# Altium schematic sheet Eth_Switch.SchDoc
size A3
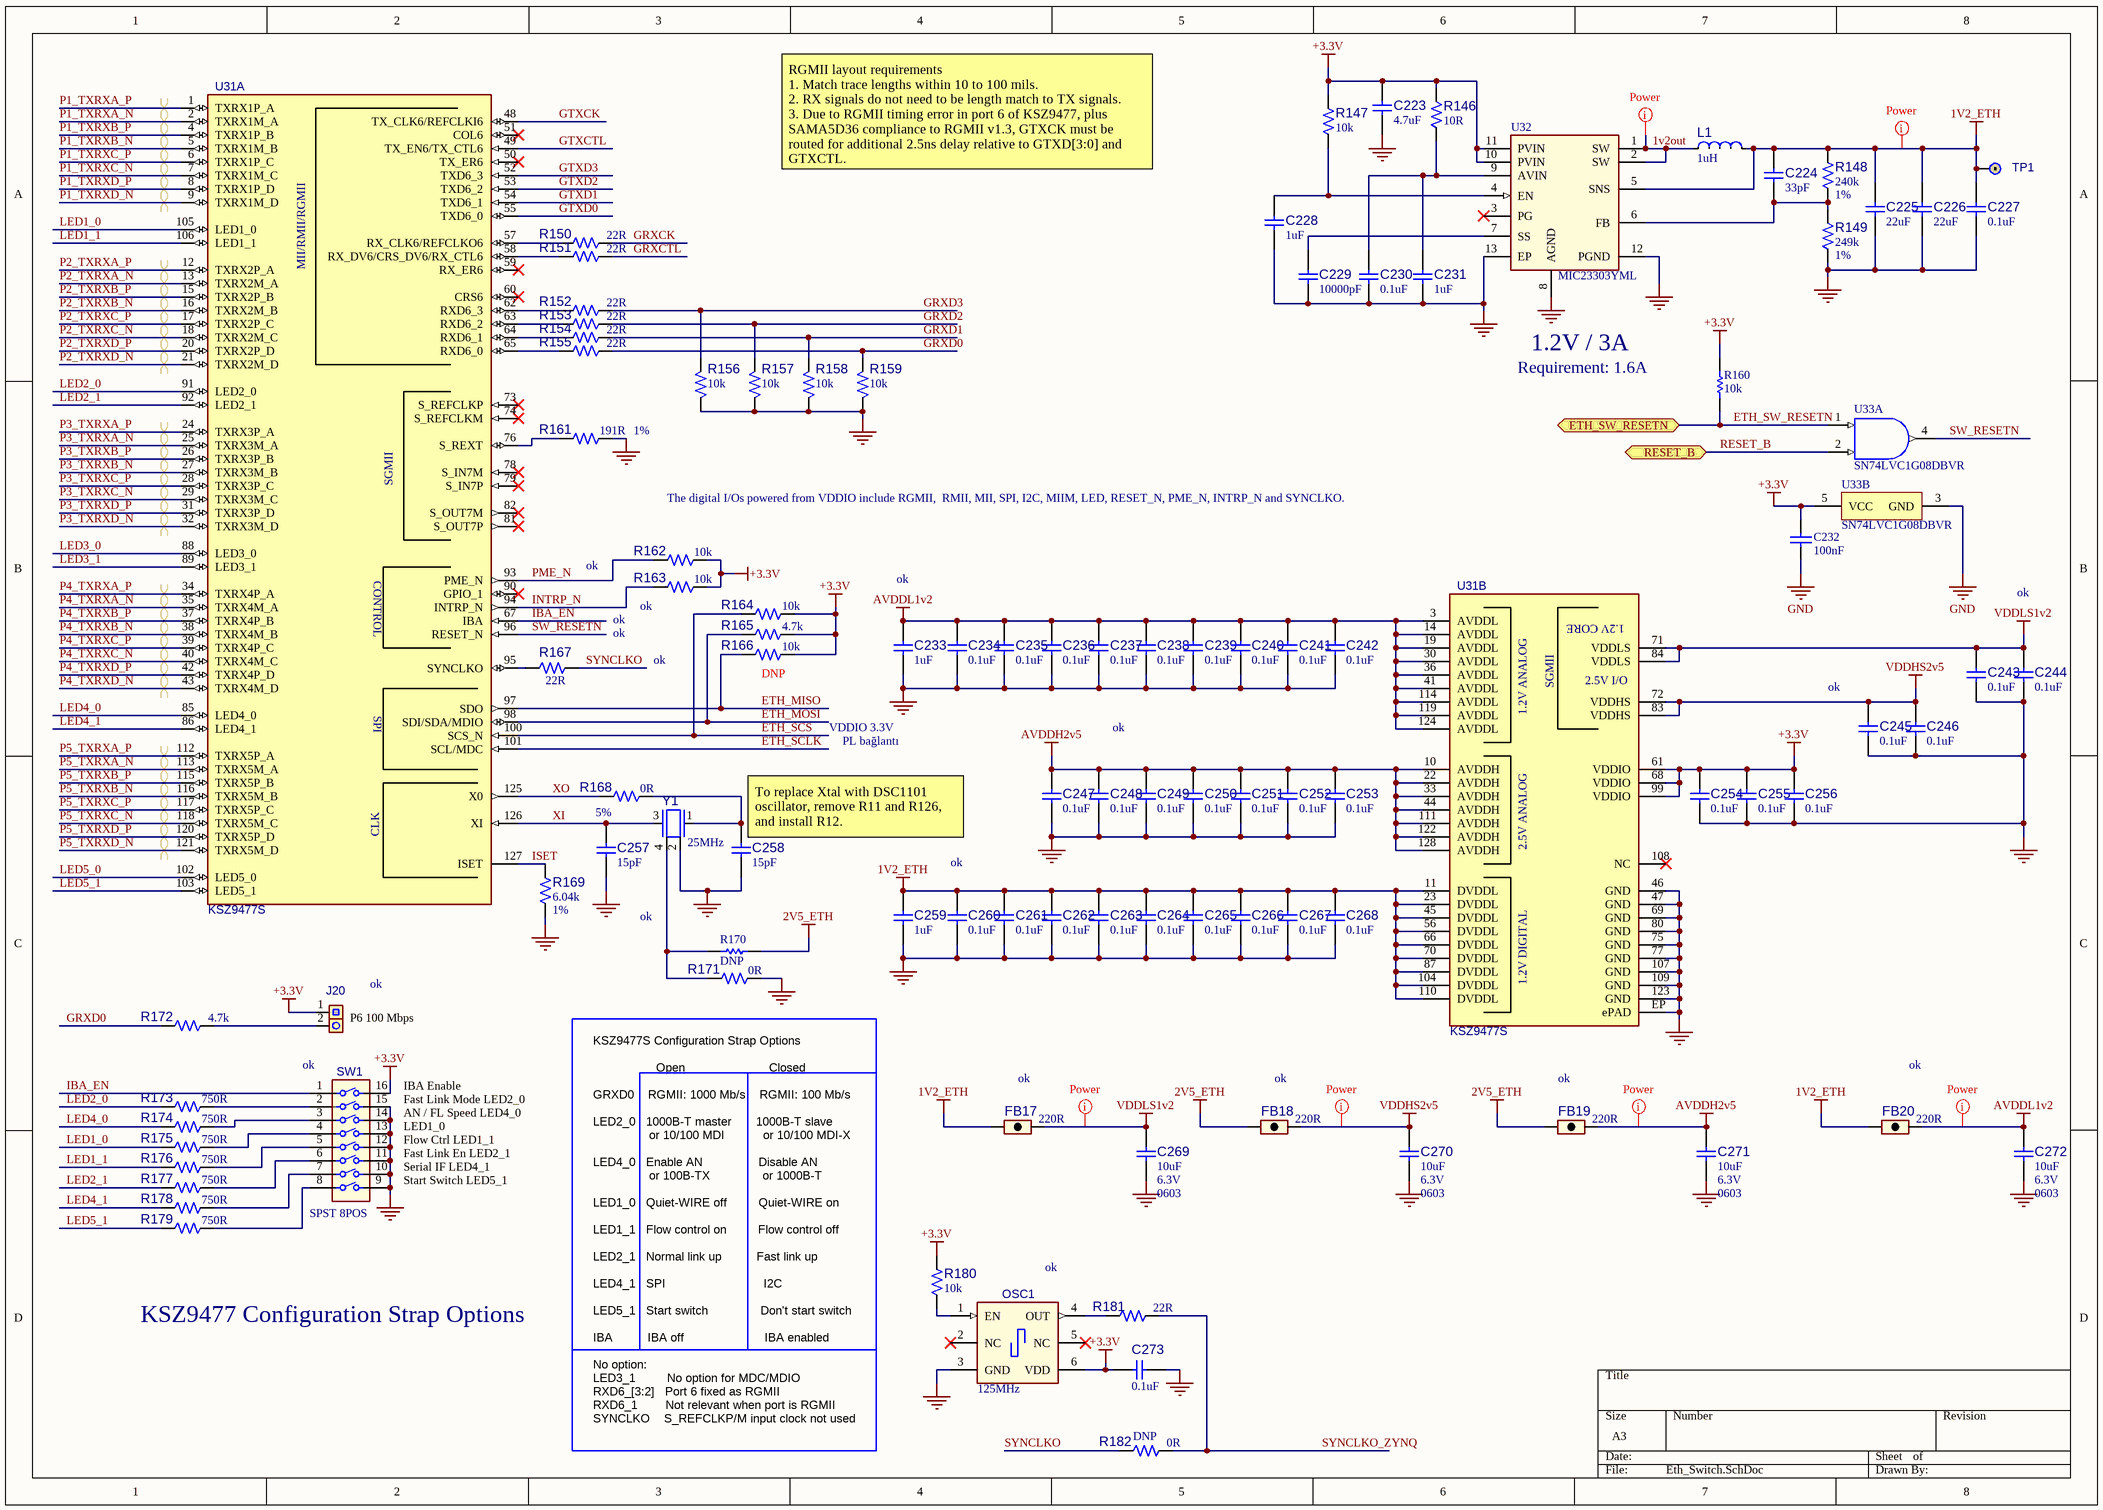
[diagram p0: Eth_Switch.SchDoc]

## Parts
C223  value 4.7uF  [CAP_C_0603]  (hidden comment: Capacitor NP)
C224  value 33pF  [CAP_C_0603]  (hidden comment: Capacitor NP)
C225  value 22uF  [CAP_C_0805]  (hidden comment: Capacitor NP)
C226  value 22uF  [CAP_C_0805]  (hidden comment: Capacitor NP)
C227  value 0.1uF  [CAP_C_0402]  (hidden comment: Capacitor NP)
C228  value 1uF  [CAP_C_0402]  (hidden comment: Capacitor NP)
C229  value 10000pF  [CAP_C_0402]  (hidden comment: Capacitor NP)
C230  value 0.1uF  [CAP_C_0402]  (hidden comment: Capacitor NP)
C231  value 1uF  [CAP_C_0402]  (hidden comment: Capacitor NP)
C232  100nF  [CAPC1005L_0402]
C233  value 1uF  [CAP_C_0402]  (hidden comment: Capacitor NP)
C234  value 0.1uF  [CAP_C_0402]  (hidden comment: Capacitor NP)
C235  value 0.1uF  [CAP_C_0402]  (hidden comment: Capacitor NP)
C236  value 0.1uF  [CAP_C_0402]  (hidden comment: Capacitor NP)
C237  value 0.1uF  [CAP_C_0402]  (hidden comment: Capacitor NP)
C238  value 0.1uF  [CAP_C_0402]  (hidden comment: Capacitor NP)
C239  value 0.1uF  [CAP_C_0402]  (hidden comment: Capacitor NP)
C240  value 0.1uF  [CAP_C_0402]  (hidden comment: Capacitor NP)
C241  value 0.1uF  [CAP_C_0402]  (hidden comment: Capacitor NP)
C242  value 0.1uF  [CAP_C_0402]  (hidden comment: Capacitor NP)
C243  value 0.1uF  [CAP_C_0402]  (hidden comment: Capacitor NP)
C244  value 0.1uF  [CAP_C_0402]  (hidden comment: Capacitor NP)
C245  value 0.1uF  [CAP_C_0402]  (hidden comment: Capacitor NP)
C246  value 0.1uF  [CAP_C_0402]  (hidden comment: Capacitor NP)
C247  value 0.1uF  [CAP_C_0402]  (hidden comment: Capacitor NP)
C248  value 0.1uF  [CAP_C_0402]  (hidden comment: Capacitor NP)
C249  value 0.1uF  [CAP_C_0402]  (hidden comment: Capacitor NP)
C250  value 0.1uF  [CAP_C_0402]  (hidden comment: Capacitor NP)
C251  value 0.1uF  [CAP_C_0402]  (hidden comment: Capacitor NP)
C252  value 0.1uF  [CAP_C_0402]  (hidden comment: Capacitor NP)
C253  value 0.1uF  [CAP_C_0402]  (hidden comment: Capacitor NP)
C254  value 0.1uF  [CAP_C_0402]  (hidden comment: Capacitor NP)
C255  value 0.1uF  [CAP_C_0402]  (hidden comment: Capacitor NP)
C256  value 0.1uF  [CAP_C_0402]  (hidden comment: Capacitor NP)
C257  value 15pF  Tolerance: 5%  [CAP_C_0402]  (hidden comment: Capacitor NP)
C258  value 15pF  [CAP_C_0402]  (hidden comment: Capacitor NP)
C259  value 1uF  [CAP_C_0402]  (hidden comment: Capacitor NP)
C260  value 0.1uF  [CAP_C_0402]  (hidden comment: Capacitor NP)
C261  value 0.1uF  [CAP_C_0402]  (hidden comment: Capacitor NP)
C262  value 0.1uF  [CAP_C_0402]  (hidden comment: Capacitor NP)
C263  value 0.1uF  [CAP_C_0402]  (hidden comment: Capacitor NP)
C264  value 0.1uF  [CAP_C_0402]  (hidden comment: Capacitor NP)
C265  value 0.1uF  [CAP_C_0402]  (hidden comment: Capacitor NP)
C266  value 0.1uF  [CAP_C_0402]  (hidden comment: Capacitor NP)
C267  value 0.1uF  [CAP_C_0402]  (hidden comment: Capacitor NP)
C268  value 0.1uF  [CAP_C_0402]  (hidden comment: Capacitor NP)
C269  value 10uF  Voltage: 6.3V  Package: 0603  [CAP_C_0603]  (hidden comment: Capacitor NP)
C270  value 10uF  Voltage: 6.3V  Package: 0603  [CAP_C_0603]  (hidden comment: Capacitor NP)
C271  value 10uF  Voltage: 6.3V  Package: 0603  [CAP_C_0603]  (hidden comment: Capacitor NP)
C272  value 10uF  Voltage: 6.3V  Package: 0603  [CAP_C_0603]  (hidden comment: Capacitor NP)
C273  value 0.1uF  [CAP_C_0402]  (hidden comment: Capacitor NP)
FB17  value 220R  [IND_C_0603]  (hidden comment: Ferrite Bead)
FB18  value 220R  [IND_C_0603]  (hidden comment: Ferrite Bead)
FB19  value 220R  [IND_C_0603]  (hidden comment: Ferrite Bead)
FB20  value 220R  [IND_C_0603]  (hidden comment: Ferrite Bead)
J20  HDR-2.54 Male 1x2  [HDR_M_2.54_1x2]  (value not drawn)
L1  value 1uH  [IND_TAI_NR_L3W3H1.5]  (hidden comment: Inductor)
OSC1  Frequency: 125MHz  [OSC_5MX3M2_A]
R146  value 10R  [RES_C_0603]  (hidden comment: Resistor)
R147  value 10k  [RES_C_0603]  (hidden comment: Resistor)
R148  value 240k  Tolerance: 1%  [RES_C_0603]  (hidden comment: Resistor)
R149  value 249k  Tolerance: 1%  [RES_C_0603]  (hidden comment: Resistor)
R150  value 22R  [RES_C_0603]  (hidden comment: Resistor)
R151  value 22R  [RES_C_0603]  (hidden comment: Resistor)
R152  value 22R  [RES_C_0603]  (hidden comment: Resistor)
R153  value 22R  [RES_C_0603]  (hidden comment: Resistor)
R154  value 22R  [RES_C_0603]  (hidden comment: Resistor)
R155  value 22R  [RES_C_0603]  (hidden comment: Resistor)
R156  value 10k  [RES_C_0603]  (hidden comment: Resistor)
R157  value 10k  [RES_C_0603]  (hidden comment: Resistor)
R158  value 10k  [RES_C_0603]  (hidden comment: Resistor)
R159  value 10k  [RES_C_0603]  (hidden comment: Resistor)
R160  value 10k  [RESC1005L_0402]  (hidden comment: RES0402_10K_0W1_05T)
R161  value 191R  Tolerance: 1%  [RES_C_0603]  (hidden comment: Resistor)
R162  value 10k  [RES_C_0603]  (hidden comment: Resistor)
R163  value 10k  [RES_C_0603]  (hidden comment: Resistor)
R164  value 10k  [RES_C_0603]  (hidden comment: Resistor)
R165  value 4.7k  [RES_C_0603]  (hidden comment: Resistor)
R166  value 10k  Populated: DNP  [RES_C_0603]  (hidden comment: Resistor)
R167  value 22R  [RES_C_0603]  (hidden comment: Resistor)
R168  value 0R  [RES_C_0603]  (hidden comment: Resistor)
R169  value 6.04k  Tolerance: 1%  [RES_C_0603]  (hidden comment: Resistor)
R170  value DNP  [RESC1005L_0402]  (hidden comment: RES0402)
R171  value 0R  [RES_C_0603]  (hidden comment: Resistor)
R172  value 4.7k  [RES_C_0603]  (hidden comment: Resistor)
R173  value 750R  [RES_C_0603]  (hidden comment: Resistor)
R174  value 750R  [RES_C_0603]  (hidden comment: Resistor)
R175  value 750R  [RES_C_0603]  (hidden comment: Resistor)
R176  value 750R  [RES_C_0603]  (hidden comment: Resistor)
R177  value 750R  [RES_C_0603]  (hidden comment: Resistor)
R178  value 750R  [RES_C_0603]  (hidden comment: Resistor)
R179  value 750R  [RES_C_0603]  (hidden comment: Resistor)
R180  value 10k  [RES_C_0603]  (hidden comment: Resistor)
R181  value 22R  [RES_C_0603]  (hidden comment: Resistor)
R182  value 0R  Populated: DNP  [RES_C_0603]  (hidden comment: Resistor)
SW1  SPST 8POS  [SW_SM_8POS24V_TE]
TP1  Jumper  [TP_PAD51D36]  (value not drawn)  (no BOM)
U31  KSZ9477S  [TQFP-128_14x14_EP10x10]  (parts A,B of 2)
U32  MIC23303YML  [DFN-12_3x3]
U33  SN74LVC1G08DBVR  [DBV0005A_N]  (parts A,B of 2)
Y1  Frequency: 25MHz  [XTAL_4PIN_3M2X2M5]  (hidden comment: XTAL 25MHz 4 pins 3225)

## Ports
ETH_SW_RESETN, RESET_B

## Nets
1V2_ETH: C224.2 C225.2 C226.2 C227.2 C259.2 C260.2 C261.2 C262.2 C263.2 C264.2 C265.2 C266.2 C267.2 C268.2 FB17.1 FB20.1 L1.2(F) R148.2 TP1.1(P1) U31.11(DVDDL) U31.23(DVDDL) U31.45(DVDDL) U31.56(DVDDL) U31.66(DVDDL) U31.70(DVDDL) U31.87(DVDDL) U31.104(DVDDL) U31.110(DVDDL) U32.5(SNS)
2V5_ETH: FB18.1 FB19.1 R170.2
+3.3V: C223.2 C232.1 C254.2 C255.2 C256.2 C273.2 J20.1(P1) OSC1.6(VDD) R146.2 R147.2 R160.2 R162.1 R163.1 R164.1 R165.1 R166.1 R180.2 SW1.16 U31.61(VDDIO) U31.68(VDDIO) U31.99(VDDIO) U32.10(PVIN) U32.11(PVIN) U33.5(VCC)
AVDDH2v5: C247.2 C248.2 C249.2 C250.2 C251.2 C252.2 C253.2 C271.2 FB19.2 U31.10(AVDDH) U31.22(AVDDH) U31.33(AVDDH) U31.44(AVDDH) U31.111(AVDDH) U31.122(AVDDH) U31.128(AVDDH)
AVDDL1v2: C233.2 C234.2 C235.2 C236.2 C237.2 C238.2 C239.2 C240.2 C241.2 C242.2 C272.2 FB20.2 U31.3(AVDDL) U31.14(AVDDL) U31.19(AVDDL) U31.30(AVDDL) U31.36(AVDDL) U31.41(AVDDL) U31.114(AVDDL) U31.119(AVDDL) U31.124(AVDDL)
GND: C223.1 C225.1 C226.1 C227.1 C228.2 C229.1 C230.1 C231.2 C232.2 C233.1 C234.1 C235.1 C236.1 C237.1 C238.1 C239.1 C240.1 C241.1 C242.1 C243.1 C244.1 C245.1 C246.1 C247.1 C248.1 C249.1 C250.1 C251.1 C252.1 C253.1 C254.1 C255.1 C256.1 C257.1 C258.1 C259.1 C260.1 C261.1 C262.1 C263.1 C264.1 C265.1 C266.1 C267.1 C268.1 C269.1 C270.1 C271.1 C272.1 C273.1 OSC1.3(GND) R149.1 R156.2 R157.2 R158.2 R159.2 R161.2 R169.1 R171.2 SW1.9 SW1.10 SW1.11 SW1.12 SW1.13 SW1.14 SW1.15 U31.46(GND) U31.47(GND) U31.69(GND) U31.75(GND) U31.77(GND) U31.80(GND) U31.107(GND) U31.109(GND) U31.123(GND) U31.EP(ePAD) U32.8(AGND) U32.12(PGND) U32.13(EP) U33.3(GND) Y1.2(GND)
VDDHS2v5: C245.2 C246.2 C270.2 FB18.2 U31.72(VDDHS) U31.83(VDDHS)
VDDLS1v2: C243.2 C244.2 C269.2 FB17.2 U31.71(VDDLS) U31.84(VDDLS)
1v2out: L1.1(S) U32.1(SW) U32.2(SW)
ETH_MISO: R166.2 U31.97(SDO)
ETH_MOSI: R165.2 U31.98(SDI/SDA/MDIO)
ETH_SCLK: U31.101(SCL/MDC)
ETH_SCS: R164.2 U31.100(SCS_N)
ETH_SW_RESETN: R160.1 U33.1(A) ; port ETH_SW_RESETN
GRXCK: R150.2
GRXCTL: R151.2
GRXD0: R155.2 R159.1 R172.1
GRXD1: R154.2 R158.1
GRXD2: R153.2 R157.1
GRXD3: R152.2 R156.1
GTXCK: U31.48(TX_CLK6/REFCLKI6)
GTXCTL: U31.49(TX_EN6/TX_CTL6)
GTXD0: U31.55(TXD6_0)
GTXD1: U31.54(TXD6_1)
GTXD2: U31.53(TXD6_2)
GTXD3: U31.52(TXD6_3)
IBA_EN: SW1.1 U31.67(IBA)
INTRP_N: R163.2 U31.94(INTRP_N)
ISET: R169.2 U31.127(ISET)
LED1_0: R175.1 U31.105(LED1_0)
LED1_1: R176.1 U31.106(LED1_1)
LED2_0: R173.1 U31.91(LED2_0)
LED2_1: R177.1 U31.92(LED2_1)
LED3_0: U31.88(LED3_0)
LED3_1: U31.89(LED3_1)
LED4_0: R174.1 U31.85(LED4_0)
LED4_1: R178.1 U31.86(LED4_1)
LED5_0: U31.102(LED5_0)
LED5_1: R179.1 U31.103(LED5_1)
P1_TXRXA_N: U31.2(TXRX1M_A)
P1_TXRXA_P: U31.1(TXRX1P_A)
P1_TXRXB_N: U31.5(TXRX1M_B)
P1_TXRXB_P: U31.4(TXRX1P_B)
P1_TXRXC_N: U31.7(TXRX1M_C)
P1_TXRXC_P: U31.6(TXRX1P_C)
P1_TXRXD_N: U31.9(TXRX1M_D)
P1_TXRXD_P: U31.8(TXRX1P_D)
P2_TXRXA_N: U31.13(TXRX2M_A)
P2_TXRXA_P: U31.12(TXRX2P_A)
P2_TXRXB_N: U31.16(TXRX2M_B)
P2_TXRXB_P: U31.15(TXRX2P_B)
P2_TXRXC_N: U31.18(TXRX2M_C)
P2_TXRXC_P: U31.17(TXRX2P_C)
P2_TXRXD_N: U31.21(TXRX2M_D)
P2_TXRXD_P: U31.20(TXRX2P_D)
P3_TXRXA_N: U31.25(TXRX3M_A)
P3_TXRXA_P: U31.24(TXRX3P_A)
P3_TXRXB_N: U31.27(TXRX3M_B)
P3_TXRXB_P: U31.26(TXRX3P_B)
P3_TXRXC_N: U31.29(TXRX3M_C)
P3_TXRXC_P: U31.28(TXRX3P_C)
P3_TXRXD_N: U31.32(TXRX3M_D)
P3_TXRXD_P: U31.31(TXRX3P_D)
P4_TXRXA_N: U31.35(TXRX4M_A)
P4_TXRXA_P: U31.34(TXRX4P_A)
P4_TXRXB_N: U31.38(TXRX4M_B)
P4_TXRXB_P: U31.37(TXRX4P_B)
P4_TXRXC_N: U31.40(TXRX4M_C)
P4_TXRXC_P: U31.39(TXRX4P_C)
P4_TXRXD_N: U31.43(TXRX4M_D)
P4_TXRXD_P: U31.42(TXRX4P_D)
P5_TXRXA_N: U31.113(TXRX5M_A)
P5_TXRXA_P: U31.112(TXRX5P_A)
P5_TXRXB_N: U31.116(TXRX5M_B)
P5_TXRXB_P: U31.115(TXRX5P_B)
P5_TXRXC_N: U31.118(TXRX5M_C)
P5_TXRXC_P: U31.117(TXRX5P_C)
P5_TXRXD_N: U31.121(TXRX5M_D)
P5_TXRXD_P: U31.120(TXRX5P_D)
PME_N: R162.2 U31.93(PME_N)
RESET_B: U33.2(B) ; port RESET_B
SW_RESETN: U31.96(RESET_N) U33.4(Y)
SYNCLKO: R167.2 R182.1
SYNCLKO_ZYNQ: R181.2 R182.2
XI: C257.2 U31.126(XI) Y1.3(Osc2)
XO: R168.1 U31.125(X0)
NetC224_1: C224.1 R148.1 R149.2 U32.6(FB)
NetC228_1: C228.1 R147.1 U32.4(EN)
NetC229_2: C229.2 U32.7(SS)
NetC230_2: C230.2 C231.1 R146.1 U32.9(AVIN)
NetC258_2: C258.2 R168.2 Y1.1(Osc1)
NetJ20_2: J20.2(P2) R172.2
NetOSC1_1: OSC1.1(EN) R180.1
NetOSC1_4: OSC1.4(OUT) R181.1
NetR150_1: R150.1 U31.57(RX_CLK6/REFCLKO6)
NetR151_1: R151.1 U31.58(RX_DV6/CRS_DV6/RX_CTL6)
NetR152_1: R152.1 U31.62(RXD6_3)
NetR153_1: R153.1 U31.63(RXD6_2)
NetR154_1: R154.1 U31.64(RXD6_1)
NetR155_1: R155.1 U31.65(RXD6_0)
NetR161_1: R161.1 U31.76(S_REXT)
NetR167_1: R167.1 U31.95(SYNCLKO)
NetR170_1: R170.1 R171.1 Y1.4(GND)
NetR173_2: R173.2 SW1.2
NetR174_2: R174.2 SW1.3
NetR175_2: R175.2 SW1.4
NetR176_2: R176.2 SW1.5
NetR177_2: R177.2 SW1.6
NetR178_2: R178.2 SW1.7
NetR179_2: R179.2 SW1.8

Not connected (* = marked no-connect by the designer): OSC1 2(NC)* 5(NC)*; U31 50(TX_ER6)* 51(COL6)* 59(RX_ER6)* 60(CRS6)* 73(S_REFCLKP)* 74(S_REFCLKM)* 78(S_IN7M)* 79(S_IN7P)* 81(S_OUT7P)* 82(S_OUT7M)* 90(GPIO_1)* 108(NC)*; U32 3(PG)*

## Layout directives
differential pair; net class Enet; net class Enet1.: P1_TXRXA_N, P1_TXRXA_P, P1_TXRXB_N, P1_TXRXB_P, P1_TXRXC_N, P1_TXRXC_P, P1_TXRXD_N, P1_TXRXD_P
differential pair; net class Enet; net class Enet2.: P2_TXRXA_N, P2_TXRXA_P, P2_TXRXB_N, P2_TXRXB_P, P2_TXRXC_N, P2_TXRXC_P, P2_TXRXD_N, P2_TXRXD_P
differential pair; net class Enet; net class Enet3.: P3_TXRXA_N, P3_TXRXA_P, P3_TXRXB_N, P3_TXRXB_P, P3_TXRXC_N, P3_TXRXC_P, P3_TXRXD_N, P3_TXRXD_P
differential pair; net class Enet; net class Enet4.: P4_TXRXA_N, P4_TXRXA_P, P4_TXRXB_N, P4_TXRXB_P, P4_TXRXC_N, P4_TXRXC_P, P4_TXRXD_N, P4_TXRXD_P
differential pair; net class Enet; net class Enet5.: P5_TXRXA_N, P5_TXRXA_P, P5_TXRXB_N, P5_TXRXB_P, P5_TXRXC_N, P5_TXRXC_P, P5_TXRXD_N, P5_TXRXD_P
net class Power (VBUS): 1V2_ETH, 1v2out, AVDDH2v5, AVDDL1v2, VDDHS2v5, VDDLS1v2

## Notes on the sheet
- RGMII layout requirements
  1. Match trace lengths within 10 to 100 mils.
  2. RX signals do not need to be length match to TX signals.
  3. Due to RGMII timing error in port 6 of KSZ9477, plus SAMA5D36 compliance to RGMII v1.3, GTXCK must be routed for additional 2.5ns delay relative to GTXD[3:0] and GTXCTL.
- Requirement: 1.6A
- 1.2V / 3A
- The digital I/Os powered from VDDIO include RGMII,  RMII, MII, SPI, I2C, MIIM, LED, RESET_N, PME_N, INTRP_N and SYNCLKO.
- ok
- (near R163) ok
- (near C245) ok
- VDDIO 3.3V
- PL bağlantı
- (near C258) To replace Xtal with DSC1101 oscillator, remove R11 and R126, and install R12.
- (near J20) ok
- (near J20) P6 100 Mbps
- (near SW1) Fast Link Mode LED2_0
- (near SW1) AN / FL Speed LED4_0
- (near SW1) IBA Enable
- (near FB17) ok
- (near FB18) ok
- (near SW1) LED1_0
- (near SW1) Flow Ctrl LED1_1
- (near SW1) Fast Link En LED2_1
- (near SW1) Serial IF LED4_1
- (near SW1) Start Switch LED5_1
- KSZ9477 Configuration Strap Options
- (near OSC1) ok
- KSZ9477S Configuration Strap Options
  Open                        Closed
  GRXD0    RGMII: 1000 Mb/s    RGMII: 100 Mb/s
  LED2_0   1000B-T master       1000B-T slave
  or 10/100 MDI           or 10/100 MDI-X
  LED4_0   Enable AN                Disable AN
  or 100B-TX               or 1000B-T
  LED1_0   Quiet-WIRE off         Quiet-WIRE on
  LED1_1   Flow control on         Flow control off
  LED2_1   Normal link up          Fast link up
  LED4_1   SPI                            I2C
  LED5_1   Start switch               Don't start switch
  IBA          IBA off                       IBA enabled
  No option:
  LED3_1         No option for MDC/MDIO
  RXD6_[3:2]   Port 6 fixed as RGMII
  RXD6_1        Not relevant when port is RGMII
  SYNCLKO    S_REFCLKP/M input clock not used
- (in symbol KSZ9477S_TQFP128, part A) MII/RMII/RGMII; SGMII; CONTROL; SPI; CLK
- (in symbol KSZ9477S_TQFP128, part B) 1.2V CORE; SGMII; 2.5V I/O; 1.2V ANALOG; 2.5V ANALOG; 1.2V DIGITAL

## Library data of the parts
C223 = CAP1288: Capacitor; Manufacturer 1: TDK Corporation; Manufacturer Part Number 1: C1608X5R1C475K080AC; Voltage: 16V; Description_: CAP CER 4.7uF 16V 10% X5R SMD 0603; Dev Tools Status: Production; Tolerance: 10%; Temperature Coeffcient: X5R; Type: Ceramic; Owner: Jairuz Agang-ang; Populated: YES; MCHP-ID: CAP1288; Package: 0603; Revision: 1; Status: MCL Design; ComponentLink1URL: https://chn-vm-apps.microchip.com/mchprepo/parts/Datasheets/mlcc_commercial_general_en.pdf; ComponentLink1Description: Datasheet; Operating Temperature: -55C to +85C; Category: Capacitor; Supplier 1: Digi-Key; Supplier Part Number 1: 445-7478-1-ND; Quantity Override: 1
C224 = CAP0088: Capacitor; Manufacturer 1: Cal-Chip; Manufacturer Part Number 1: GMC10CG330J50NTLF; Voltage: 50V; Description_: CAP CER 33pF 50V 5% NP0 SMD 0603; Dev Tools Status: Production; Tolerance: 5%; Temperature Coeffcient: NP0; Type: Ceramic; Populated: Yes; MCHP-ID: CAP0088; Package: 0603; Revision: 1; Status: MCL Design; ComponentLink1URL: https://chn-vm-apps.microchip.com/mchprepo/parts/Datasheets/KEM_C1002_X7R_SMD.pdf; ComponentLink1Description: Datasheet; Operating Temperature: -55C to +125C; Category: Capacitor; Manufacturer 2: KEMET; Manufacturer Part Number 2: C0603C330J5GACTU; Manufacturer 3: Panasonic; Manufacturer Part Number 3: ECU-V1H330JCV; Manufacturer 4: TDK; Manufacturer Part Number 4: C1608C0G1H330J; Manufacturer 5: Yageo; Manufacturer Part Number 5: CC0603JRNP09BN330; Manufacturer 6: NIC Components; Manufacturer Part Number 6: NMC0603NPO330J50TRPF; Manufacturer 7: Panasonic; Manufacturer Part Number 7: ECJ-1VC1H330J; Supplier 1: Cal-Chip; Supplier Part Number 1: GMC10CG330J50NTLF; Supplier 2: Digi-Key; Supplier Part Number 2: 399-1055-1-ND; Supplier 3: Digi-Key; Supplier Part Number 3: PCC330ACVTR-ND; Supplier 4: Digi-Key; Supplier Part Number 4: 445-1275-2-ND; Supplier 5: Digi-Key; Supplier Part Number 5: 311-1064-1-ND; Supplier 6: NIC Components; Supplier Part Number 6: NMC0603NPO330J50TRPF; Supplier 7: Panasonic; Supplier Part Number 7: ECJ-1VC1H330J; Quantity Override: 1
C225 C226 = CAP0627: Capacitor; Manufacturer 1: TDK; Manufacturer Part Number 1: C2012X5R1C226K; Voltage: 16V; Description_: CAP CER 22uF 16V 10% X5R SMD 0805; Dev Tools Status: Production; Tolerance: 10%; Temperature Coeffcient: X5R; Type: Ceramic; Populated: Yes; MCHP-ID: CAP0627; Package: 0805; Revision: 1; Status: MCL Design; ComponentLink1URL: https://chn-vm-apps.microchip.com/mchprepo/parts/Datasheets/general_B11.pdf; ComponentLink1Description: Datasheet; Operating Temperature: -55C to +85C; Category: Capacitor; Supplier 1: Digi-Key; Supplier Part Number 1: 445-6797-2-ND; Quantity Override: 1
C227 C230 C234-C256 C260-C268 C273 = CAP1463: Capacitor; Manufacturer 1: TDK Corporation; Manufacturer Part Number 1: C1005X7R1H104K050BB; Voltage: 50V; Description_: CAP CER 0.1uF 50V 10% X7R SMD 0402; Dev Tools Status: Design; Tolerance: 10%; Temperature Coeffcient: X7R; Type: Ceramic; Owner: Jamus Griego; Populated: YES; MCHP-ID: CAP1463; Package: 0402; Revision: A; Status: MCL Design; ComponentLink1URL: https://chn-vm-apps.microchip.com/mchprepo/parts/Datasheets/TDKMLCCCapRange.pdf; ComponentLink1Description: Datasheets; Operating Temperature: -55C to +125C; Category: Capacitor; Supplier 1: Digi-Key; Supplier Part Number 1: 445-5932-1-ND; Quantity Override: 1
C228 C231 C233 C259 = CAP1065: Capacitor; Manufacturer 1: TDK Corporation; Manufacturer Part Number 1: C1005X5R1C105K; Voltage: 16V; Description_: CAP CER 1uF 16V 10% X5R SMD 0402; Dev Tools Status: Production; Tolerance: 10%; Temperature Coeffcient: X5R; Type: Ceramic; Owner: Tad Ahlvers; Populated: YES; MCHP-ID: CAP1065; Package: 0402; Revision: 1; Status: MCL Design; ComponentLink1URL: https://chn-vm-apps.microchip.com/mchprepo/parts/Datasheets/general_B11.pdf; ComponentLink1Description: Datasheet; Operating Temperature: -55C to +85C; Category: Capacitor; Supplier 1: Digi-Key; Supplier Part Number 1: 445-4978-2-ND; Quantity Override: 1
C229 = CAP0278: Capacitor; Manufacturer 1: KEMET; Manufacturer Part Number 1: C0402C103K4RACTU; Voltage: 16V; Description_: CAP CER 10000pF 16V 10% X7R SMD 0402; Dev Tools Status: Production; Tolerance: 10%; Temperature Coeffcient: X7R; Type: Ceramic; Populated: YES; MCHP-ID: CAP0278; Package: 0402; Revision: 1; Status: MCL Design; ComponentLink1URL: https://chn-vm-apps.microchip.com/mchprepo/parts/Datasheets/KEM_C1002_X7R_SMD.pdf; ComponentLink1Description: Datasheet; Operating Temperature: -55C to +125C; Category: Capacitor; Manufacturer 2: KEMET; Manufacturer Part Number 2: C0402C103K4RAC; Supplier 1: Digi-Key; Supplier Part Number 1: 399-1038-1-ND; Supplier 2: KEMET; Supplier Part Number 2: C0402C103K4RAC; Quantity Override: 1
C232 = CAPCER0402X7R100N25V_10T: CAP CER 0.1UF 25V X7R 0402; Manufacturer 1: Murata Electronics North America; Manufacturer Part Number 1: GRM155R71E104KE14D; Tolerance: 10%; Package: 0402; ComponentLink1Description: Datasheet; Value: 100nF; Voltage: 25V; Temperature Coefficient: X7R; Supplier 1: Digi-Key; Supplier Part Number 1: 490-10698-1-ND; Operating Temperature: -55°C ~ 125°C
C257 = CAP0608: Capacitor; Manufacturer 1: Murata; Manufacturer Part Number 1: GRM1555C1H150JA01D; Voltage: 50V; Description_: CAP CER 15pF 50V 5% NP0 SMD 0402; Dev Tools Status: Production; Temperature Coeffcient: NP0; Type: Ceramic; Populated: Yes; MCHP-ID: CAP0608; Package: 0402; Revision: 1; Status: MCL Design; ComponentLink1URL: https://chn-vm-apps.microchip.com/mchprepo/parts/Datasheets/L0005E.pdf; ComponentLink1Description: Datasheet; Operating Temperature: -55C to +125C; Category: Capacitor; Manufacturer 2: Murata; Manufacturer Part Number 2: GRM1555C1H150JZ01D; Supplier 1: Digi-Key; Supplier Part Number 1: 490-5888-2-ND; Supplier 2: Digi-Key; Supplier Part Number 2: 490-1280-1-ND; Quantity Override: 1
C258 = CAP0608: Capacitor; Manufacturer 1: Murata; Manufacturer Part Number 1: GRM1555C1H150JA01D; Voltage: 50V; Description_: CAP CER 15pF 50V 5% NP0 SMD 0402; Dev Tools Status: Production; Tolerance: 5%; Temperature Coeffcient: NP0; Type: Ceramic; Populated: Yes; MCHP-ID: CAP0608; Package: 0402; Revision: 1; Status: MCL Design; ComponentLink1URL: https://chn-vm-apps.microchip.com/mchprepo/parts/Datasheets/L0005E.pdf; ComponentLink1Description: Datasheet; Operating Temperature: -55C to +125C; Category: Capacitor; Manufacturer 2: Murata; Manufacturer Part Number 2: GRM1555C1H150JZ01D; Supplier 1: Digi-Key; Supplier Part Number 1: 490-5888-2-ND; Supplier 2: Digi-Key; Supplier Part Number 2: 490-1280-1-ND; Quantity Override: 1
C269-C272 = CAP0533: Capacitor; Manufacturer 1: AVX; Manufacturer Part Number 1: 06036D106MAT2A; Description_: CAP CER 10uF 6.3V 20% X5R SMD 0603; Dev Tools Status: Production; Tolerance: 20%; Temperature Coeffcient: X5R; Type: Ceramic; Populated: Yes; MCHP-ID: CAP0533; Revision: 1; Status: MCL Design; ComponentLink1URL: https://chn-vm-apps.microchip.com/mchprepo/parts/Datasheets/smccp.pdf; ComponentLink1Description: Datasheet; Operating Temperature: -55C to +85C; Category: Capacitor; Manufacturer 2: KEMET; Manufacturer Part Number 2: C0603C106M9PACTU; Manufacturer 3: Murata; Manufacturer Part Number 3: GRM188R60J106ME47D; Manufacturer 4: TDK Corporation; Manufacturer Part Number 4: C1608X5R0J106M080AB; Manufacturer 5: TDK Corporation; Manufacturer Part Number 5: C1608X5R0J106M; Supplier 1: Digi-Key; Supplier Part Number 1: 478-5318-2-ND; Supplier 2: Digi-Key; Supplier Part Number 2: 399-5504-1-ND; Supplier 3: Digi-Key; Supplier Part Number 3: 490-3896-2-ND; Supplier 4: Digi-Key; Supplier Part Number 4: 445-4112-1-ND; Quantity Override: 1
FB17-FB20 = IND1313: Manufacturer 1: Murata Electronics North America; Manufacturer Part Number 1: BLM18EG221SN1D; Description_: FERRITE 220R @ 100MHz 2A SMD 0603; Dev Tools Status: Design; Owner: Razvan Cristescu; Populated: YES; MCHP-ID: IND1313; Revision: A; Symbol: Ferrite Bead; Status: MCL Design; ComponentLink1Description: Datasheet; Package: 0603; Type: Ferrite Bead; Category: Inductor; Supplier 1: Digi-Key; Supplier Part Number 1: 490-3992-6-ND; Quantity Override: 1
J20 = Header 1x2: CONN HEADER 2POS .100" SGL GOLD; Manufacturer Part Number 1: TSW-102-07-G-S; Manufacturer 1: Samtec; Part Checked: Jennifer Hancock; Description_: CON HDR-2.54 MALE 1x2 GOLD 5.84MH TH VERT; Populated: Yes; Package: Through Hole; Supplier 1: Digi-Key; Supplier Part Number 1: SAM1029-02-ND; Value: HDR-2.54 Male 1x2; Part Footprint Checked: *; Part Golden: Jennifer Hancock; Part 3D Model Checked: Jennifer Hancock; Manufacturer 2: FCI; Manufacturer Part Number 2: 68000-236HLF; Revision Date: 08/14/2015; Tolerance: *; Rating: *; Owner: *; Document Link: //depot_np_hweng_boards/altium_libraries/datasheets/Samtec/TSW_TH.pdf
L1 = IND1027: Manufacturer 1: Taiyo Yuden; Manufacturer Part Number 1: NR3015T1R0N; Description_: INDUCTOR 1uH 2.1A 30% SMD L3W3H1.5; Dev Tools Status: Production; Owner: Tad Ahlvers; DCR: 0.036R; Saturation Current: 2.1A; Test Frequency: 100kHz; Populated: YES; MCHP-ID: IND1027; Revision: 1; Status: MCL Design; ComponentLink1URL: https://chn-vm-apps.microchip.com/mchprepo/parts/Datasheets/NR3015T1R0N.pdf; ComponentLink1Description: Datasheet; Operating Temperature: -25C to +120C; Package: L3W3H1.5; Type: Inductor; Category: Inductor; Supplier 1: Digi-Key; Supplier Part Number 1: 587-1647-1-ND; Quantity Override: 1
OSC1 = DSC1101B12-125.0000: OSC MEMS 125.000MHZ CMOS SMD; Manufacturer 1: Micrel; Manufacturer Part Number 1: DSC1101BI2-125.0000; Populated: Yes; Supplier 1: Digi-Key; Category: Crystals and Oscillators; ComponentLink1URL: http://www.ctscorp.com/components/Datasheets/008-0256-0.pdf; ComponentLink1Description: Datasheet; Description_: OSC MEMS 125.000MHZ CMOS SMD; RoHS: RoHS Compliant; Package: 5.0mm x 3.2mm
R146 = RSMT1021: Manufacturer 1: Stackpole Electronics Inc; Manufacturer Part Number 1: RMCF0603FT10R0; Tolerance: 1%; Description_: RES TKF 10R 1% 1/10W SMD 0603; Dev Tools Status: Production; Voltage: 50V; Temperature Coeffcient: 100ppm/C; Current: 1A; Power: 1/10W; Owner: Aaron VanDuerm; Populated: Yes; MCHP-ID: RSMT1021; Package: 0603; Revision: 1; Status: MCL Design; ComponentLink1URL: https://chn-vm-apps.microchip.com/mchprepo/parts/Datasheets/SEI-RMCF_RMCP.pdf; ComponentLink1Description: Datasheet; Operating Temperature: -55C to +155C; Category: Resistor; Type: RES SMD; Composition: TKF; Supplier 1: Digi-Key; Supplier Part Number 1: RMCF0603FT10R0CT-ND; Quantity Override: 1
R147 R156-R159 R162-R164 R180 = RSMT0139: Manufacturer 1: Panasonic; Manufacturer Part Number 1: ERJ-3EKF1002V; Tolerance: 1%; Description_: RES TKF 10k 1% 1/10W SMD 0603; Dev Tools Status: Production; Temperature Coeffcient: 100ppm/C; Power: 1/10W; Populated: Yes; MCHP-ID: RSMT0139; Package: 0603; Revision: 2; Status: MCL Design; ComponentLink1URL: https://chn-vm-apps.microchip.com/mchprepo/parts/Datasheets/nrc.pdf; ComponentLink1Description: Datasheet; Operating Temperature: -55C to +155C; Category: Resistor; Type: RES SMD; Composition: TKF; Manufacturer 2: Stackpole Electronics Inc; Manufacturer Part Number 2: RMCF0603FT10K0; Manufacturer 3: Yageo; Manufacturer Part Number 3: RC0603FR-0710KL; Manufacturer 4: Stackpole Electronics Inc; Manufacturer Part Number 4: RMCF 1/16 10K 1% R; Manufacturer 5: Xicon; Manufacturer Part Number 5: 302-10K-RC; Manufacturer 6: NIC Components; Manufacturer Part Number 6: NRC06F1002TRF; Supplier 1: Digi-Key; Supplier Part Number 1: P10.0KHCT-ND; Supplier 2: Digi-Key; Supplier Part Number 2: RMCF1/1610KFRTR-ND; Supplier 3: Digi-Key; Supplier Part Number 3: 311-10.0KHRCT-ND; Supplier 4: Digi-Key; Supplier Part Number 4: RMCF0603FT10K0TR-ND; Supplier 5: Mouser; Supplier Part Number 5: 302-10k-RC; Supplier 6: NIC Components; Supplier Part Number 6: NRC06F1002TRF; Quantity Override: 1
R148 = RES1562: Manufacturer 1: Panasonic Electronic Components; Manufacturer Part Number 1: ERJ-3EKF2403V; Description_: RES TKF 240k 1% 1/10W SMD 0603; Dev Tools Status: Design; Voltage: 75V; Temperature Coeffcient: 100ppm/C; Power: 1/10W; Owner: Tad Ahlvers; Populated: YES; MCHP-ID: RES1562; Package: 0603; Revision: A; Status: MCL Design; ComponentLink1URL: https://chn-vm-apps.microchip.com/mchprepo/parts/Datasheets/AOA0000CE2.pdf; ComponentLink1Description: Datasheet; Operating Temperature: -55C to +155C; Category: Resistor; Type: RES SMD; Composition: TKF; Supplier 1: Digi-Key; Supplier Part Number 1: P240KHCT-ND; Quantity Override: 1
R149 = RSMT0556: Manufacturer 1: Panasonic; Manufacturer Part Number 1: ERJ-3EKF2493V; Description_: RES TKF 249k 1% 1/10W SMD 0603; Dev Tools Status: Production; Voltage: 75V; Temperature Coeffcient: 100ppm/C; Power: 1/10W; Populated: Yes; MCHP-ID: RSMT0556; Package: 0603; Revision: 1; Status: MCL Design; ComponentLink1URL: https://chn-vm-apps.microchip.com/mchprepo/parts/Datasheets/AOA0000CE2.pdf; ComponentLink1Description: Datasheet; Operating Temperature: -55C to +155C; Category: Resistor; Type: RES SMD; Composition: TKF; Supplier 1: Digi-Key; Supplier Part Number 1: P249KHCT-ND; Quantity Override: 1
R150-R155 R167 R181 = RSMT0454: Manufacturer 1: Yageo; Manufacturer Part Number 1: RC0603FR-0722RL; Tolerance: 1%; Description_: RES TKF 22R 1% 1/10W SMD 0603; Dev Tools Status: Production; Voltage: 50V; Temperature Coeffcient: 100ppm/C; Power: 1/10W; Populated: YES; MCHP-ID: RSMT0454; Package: 0603; Revision: 2; Status: MCL Design; ComponentLink1URL: https://chn-vm-apps.microchip.com/mchprepo/parts/Datasheets/PYu-RC0603_51_RoHS_L_4.pdf; ComponentLink1Description: Datasheet; Operating Temperature: -55C to +155C; Category: Resistor; Type: RES SMD; Composition: TKF; Supplier 1: Digi-Key; Supplier Part Number 1: 311-22.0HRCT-ND; Quantity Override: 1
R160 = RES0402_10K_0W1_05T: RES SMD 10K OHM 0.5% 1/16W 0402; Manufacturer 1: Panasonic Electronic Components; Manufacturer Part Number 1: ERJ-2RHD1002X; Package: 0402; ComponentLink1Description: Datasheet; Power: 1/16W; Tolerance: 0.5%; Supplier 1: Digi-Key; Supplier Part Number 1: P15984CT-ND
R161 = RES1665: Manufacturer 1: Yageo; Manufacturer Part Number 1: RC0603FR-07191RL; Description_: RES TKF 191R 1% 1/10W SMD 0603; Dev Tools Status: Design; Temperature Coeffcient: ±100ppm/°C; Power: 1/10W; Owner: Sam Charles; Populated: YES; MCHP-ID: RES1665; Package: 0603; Revision: A; Symbol: RESISTOR; Status: MCL Design; ComponentLink1URL: https://chn-vm-apps.microchip.com/mchprepo/parts/Datasheets/PYu-R_INT-thick_7.pdf; ComponentLink1Description: datasheet; Operating Temperature: -55°C ~ 155°C; Category: Resistor; Type: RES SMD; Composition: TKF; Supplier 1: Digi-Key; Supplier Part Number 1: 311-191HRCT-ND; Quantity Override: 1
R165 R172 = RSMT0713: Manufacturer 1: ROHM; Manufacturer Part Number 1: MCR03EZPFX4701; Tolerance: 1%; Description_: RES TKF 4.7k 1% 1/10W SMD 0603; Dev Tools Status: Production; Voltage: 50V; Temperature Coeffcient: 100ppm/C; Current: 1A; Power: 1/10W; Populated: Yes; MCHP-ID: RSMT0713; Package: 0603; Revision: 2; Status: MCL Design; ComponentLink1URL: https://chn-vm-apps.microchip.com/mchprepo/parts/Datasheets/SEI-RMCF_RMCP.pdf; ComponentLink1Description: Datasheet; Operating Temperature: -55C to +155C; Category: Resistor; Type: RES SMD; Composition: TKF; Manufacturer 2: Stackpole Electronics Inc; Manufacturer Part Number 2: RMCF0603FT4K70; Manufacturer 3: Yageo; Manufacturer Part Number 3: RC0603FR-074K7L; Supplier 1: Digi-Key; Supplier Part Number 1: RHM4.70KHCT-ND; Supplier 2: Digi-Key; Supplier Part Number 2: RMCF0603FT4K70CT-ND; Supplier 3: Digi-Key; Supplier Part Number 3: 311-4.70KHRTR-ND; Quantity Override: 1
R166 = RSMT0139: Manufacturer 1: Panasonic; Manufacturer Part Number 1: ERJ-3EKF1002V; Tolerance: 1%; Description_: RES TKF 10k 1% 1/10W SMD 0603; Dev Tools Status: Production; Temperature Coeffcient: 100ppm/C; Power: 1/10W; MCHP-ID: RSMT0139; Package: 0603; Revision: 2; Status: MCL Design; ComponentLink1URL: https://chn-vm-apps.microchip.com/mchprepo/parts/Datasheets/nrc.pdf; ComponentLink1Description: Datasheet; Operating Temperature: -55C to +155C; Category: Resistor; Type: RES SMD; Composition: TKF; Manufacturer 2: Stackpole Electronics Inc; Manufacturer Part Number 2: RMCF0603FT10K0; Manufacturer 3: Yageo; Manufacturer Part Number 3: RC0603FR-0710KL; Manufacturer 4: Stackpole Electronics Inc; Manufacturer Part Number 4: RMCF 1/16 10K 1% R; Manufacturer 5: Xicon; Manufacturer Part Number 5: 302-10K-RC; Manufacturer 6: NIC Components; Manufacturer Part Number 6: NRC06F1002TRF; Supplier 1: Digi-Key; Supplier Part Number 1: P10.0KHCT-ND; Supplier 2: Digi-Key; Supplier Part Number 2: RMCF1/1610KFRTR-ND; Supplier 3: Digi-Key; Supplier Part Number 3: 311-10.0KHRCT-ND; Supplier 4: Digi-Key; Supplier Part Number 4: RMCF0603FT10K0TR-ND; Supplier 5: Mouser; Supplier Part Number 5: 302-10k-RC; Supplier 6: NIC Components; Supplier Part Number 6: NRC06F1002TRF; Quantity Override: 1
R168 R171 = RSMT0001: Manufacturer 1: Panasonic; Manufacturer Part Number 1: ERJ-3GSY0R00V; Description_: RES TKF 0R 1/10W SMD 0603; Dev Tools Status: Production; Power: 1/10W; Populated: Yes; MCHP-ID: RSMT0001; Package: 0603; Revision: 2; Status: MCL Design; ComponentLink1URL: https://chn-vm-apps.microchip.com/mchprepo/parts/Datasheets/nrc.pdf; ComponentLink1Description: Datasheet; Operating Temperature: -55C to +155C; Category: Resistor; Type: RES SMD; Composition: TKF; Manufacturer 2: Panasonic; Manufacturer Part Number 2: ERJ-3GEY0R00V; Manufacturer 3: ROHM; Manufacturer Part Number 3: MCR03EZPJ000; Manufacturer 4: Stackpole Electronics Inc; Manufacturer Part Number 4: RMCF0603ZT0R00; Manufacturer 5: Stackpole Electronics Inc; Manufacturer Part Number 5: RMCF 1/16 0 R; Manufacturer 6: Vishay; Manufacturer Part Number 6: CRCW06030000Z0EA; Manufacturer 7: Yageo; Manufacturer Part Number 7: RC0603JR-070RL; Manufacturer 8: KOA Speer; Manufacturer Part Number 8: RK73Z1JTTP; Manufacturer 9: NIC Components; Manufacturer Part Number 9: NRC06Z0TRF; Supplier 1: Digi-Key; Supplier Part Number 1: P0.0GTR-ND; Supplier 2: Digi-Key; Supplier Part Number 2: RHM0.0GCT-ND; Supplier 3: Digi-Key; Supplier Part Number 3: RMCF0603ZT0R00TR-ND; Supplier 4: Digi-Key; Supplier Part Number 4: RMCF0603ZT0R00CT-ND; Supplier 5: Digi-Key; Supplier Part Number 5: RMCF1/160RTR-ND; Supplier 6: Digi-Key; Supplier Part Number 6: 541-0.0GCT-ND; Supplier 7: Digi-Key; Supplier Part Number 7: 311-0.0GRCT-ND; Supplier 8: KOA Speer; Supplier Part Number 8: RK73Z1JTTP; Supplier 9: NIC Components; Supplier Part Number 9: NRC06Z0TRF; Quantity Override: 1
R169 = RSMT0277: Manufacturer 1: Yageo; Manufacturer Part Number 1: 9T06031A6041FBHFT; Description_: RES TKF 6.04k 1% 1/10W SMD 0603; Dev Tools Status: Production; Voltage: 50V; Temperature Coeffcient: 100ppm/C; Power: 1/10W; Populated: Yes; MCHP-ID: RSMT0277; Package: 0603; Revision: 1; Status: MCL Design; ComponentLink1URL: https://chn-vm-apps.microchip.com/mchprepo/parts/Datasheets/SEI-RMCF_RMCP.pdf; ComponentLink1Description: Datasheet; Operating Temperature: -55C to +155C; Category: Resistor; Type: RES SMD; Composition: TKF; Manufacturer 2: Stackpole Electronics Inc; Manufacturer Part Number 2: RMCF 1/16 6.04K 1% TR; Manufacturer 3: Stackpole Electronics Inc; Manufacturer Part Number 3: RMC 1/16 6.04K 1% TR; Manufacturer 4: Yageo; Manufacturer Part Number 4: 9T06031A6041FBPFT; Supplier 1: Digi-Key; Supplier Part Number 1: 9T06031A6041FBHFT-ND; Supplier 2: Stackpole Electronics Inc; Supplier Part Number 2: RMCF 1/16 6.04K 1% TR; Supplier 3: Stackpole Electronics Inc; Supplier Part Number 3: RMC 1/16 6.04K 1% TR; Supplier 4: Yageo; Supplier Part Number 4: 9T06031A6041FBPFT; Quantity Override: 1
R170 = RES0402: RES SMD 0402 Footprint; Package: 0402; ComponentLink1Description: Datasheet; Tolerance: -
R173-R179 = RES1052: Manufacturer 1: Vishay; Manufacturer Part Number 1: CRCW0603750RFKEA; Tolerance: 1%; Description_: RES TKF 750R 1% 1/10W SMD 0603; Dev Tools Status: Production; Voltage: 75V; Temperature Coeffcient: 100ppm/C; Power: 1/10W; Owner: Tad Ahlvers; Populated: YES; MCHP-ID: RES1052; Package: 0603; Revision: 1; Status: MCL Design; ComponentLink1URL: https://chn-vm-apps.microchip.com/mchprepo/parts/Datasheets/dcrcwe3.pdf; ComponentLink1Description: Datasheet; Operating Temperature: -55C to +155C; Category: Resistor; Type: RES SMD; Composition: TKF; Supplier 1: Digi-Key; Supplier Part Number 1: 541-750HCT-ND; Quantity Override: 1
R182 = RSMT0001: Manufacturer 1: Panasonic; Manufacturer Part Number 1: ERJ-3GSY0R00V; Description_: RES TKF 0R 1/10W SMD 0603; Dev Tools Status: Production; Power: 1/10W; MCHP-ID: RSMT0001; Package: 0603; Revision: 2; Status: MCL Design; ComponentLink1URL: https://chn-vm-apps.microchip.com/mchprepo/parts/Datasheets/nrc.pdf; ComponentLink1Description: Datasheet; Operating Temperature: -55C to +155C; Category: Resistor; Type: RES SMD; Composition: TKF; Manufacturer 2: Panasonic; Manufacturer Part Number 2: ERJ-3GEY0R00V; Manufacturer 3: ROHM; Manufacturer Part Number 3: MCR03EZPJ000; Manufacturer 4: Stackpole Electronics Inc; Manufacturer Part Number 4: RMCF0603ZT0R00; Manufacturer 5: Stackpole Electronics Inc; Manufacturer Part Number 5: RMCF 1/16 0 R; Manufacturer 6: Vishay; Manufacturer Part Number 6: CRCW06030000Z0EA; Manufacturer 7: Yageo; Manufacturer Part Number 7: RC0603JR-070RL; Manufacturer 8: KOA Speer; Manufacturer Part Number 8: RK73Z1JTTP; Manufacturer 9: NIC Components; Manufacturer Part Number 9: NRC06Z0TRF; Supplier 1: Digi-Key; Supplier Part Number 1: P0.0GTR-ND; Supplier 2: Digi-Key; Supplier Part Number 2: RHM0.0GCT-ND; Supplier 3: Digi-Key; Supplier Part Number 3: RMCF0603ZT0R00TR-ND; Supplier 4: Digi-Key; Supplier Part Number 4: RMCF0603ZT0R00CT-ND; Supplier 5: Digi-Key; Supplier Part Number 5: RMCF1/160RTR-ND; Supplier 6: Digi-Key; Supplier Part Number 6: 541-0.0GCT-ND; Supplier 7: Digi-Key; Supplier Part Number 7: 311-0.0GRCT-ND; Supplier 8: KOA Speer; Supplier Part Number 8: RK73Z1JTTP; Supplier 9: NIC Components; Supplier Part Number 9: NRC06Z0TRF; Quantity Override: 1
SW1 = Switch DIP 8 Pos: Switch DIP SPST 8POS SMD; Manufacturer 1: TE Connectivity Alcoswitch Switches; Manufacturer Part Number 1: 1-1825058-9; Description_: SWITCH SLIDE SPST 24V 100mA 1825058-9EXT ACT 8POS 24V; Voltage Rating: 24VDC; Populated: Yes; Supplier 1: Mouser; Supplier 2: Digi-Key; RoHS: Yes; ComponentLink1URL: http://www.te.com/commerce/DocumentDelivery/DDEController?Action=srchrtrv&DocNm=1825058&DocType=Customer+Drawing&DocLang=English; ComponentLink1Description: http://www.te.com/commerce/DocumentDelivery/DDEController?Action=srchrtrv&DocNm=1825058&DocType=Customer+Drawing&DocLang=English; Supplier Part Number 1: 506-ADE08S04; Supplier Part Number 2: 1-1825058-9-ND; Value: SPST 8POS
TP1 = TEST PAD TH 51X36: Manufacturer Part Number: none; Description_: TEST Pad, PIN sized, 51pad, 36 FHS; Populated: Yes; Manufacturer: none; Category: Non BOM Item; Type: Male; Mounting Type: Through Hole; Supplier 1: none; Supplier Part Number 1: none
U31 = KSZ9477S_TQFP128: IC, 7-Port Gigabit Ethernet Switch with 2 RGMII / MII / RMII Interfaces, TQFP128; Manufacturer 1: Micrel; Populated: Yes; Owner: sam charles; Manufacturer Part Number 1: KSZ9477S; Description_: IC, 7-Port Gigabit Ethernet Switch with 2 RGMII / MII / RMII Interfaces, TQFP128; Revision Date: 06/03/2016; RoHS: Yes; Package: TQFP128-14x14; Document Link: http://nyusperforce.smsc.com//depot_np_hweng_boards/altium_libraries/datasheets/_Microchip/_Micrel/KSZ9897R.pdf; Status: New; Value: KSZ9477S
U32 = MIC23303YML: 4MHz PWM 3A Buck Regulator with HyperLight Load and Power Good; Part Checked: Carl Johnson; Manufacturer 1: Microchip Technology; Populated: Yes; Temperature Rating: -40 to +125 C; Description_: 4MHz PWM 3A Buck Regulator with HyperLight Load and Power Good; Document Link: http://nyusperforce.smsc.com//depot_np_hweng_boards/altium_libraries/datasheets/_Microchip/_Micrel/MIC23303.pdf; Owner: *; Part 3D Model Checked: *; Part Footprint Checked: *; Part Golden: *; Revision Date: 06/20/16; Package: DFN12-3x3; Manufacturer Part Number 1: MIC23303YML; Supplier 1: DigiKey; Supplier 2: Mouser; Supplier Part Number 1: 1611-MIC23303YML-T5CT-ND; Supplier Part Number 2: 998-MIC23303YMLT5; Value: MIC23303YML
U33 = SN74LVC1G08DBVR: Single 2-Input Positive-AND Gate, DBV0005A, LARGE T&R; Manufacturer 1: Texas Instruments; VCC(Min)(V): 1.65; VCC(Max)(V): 5.5; Output Type: CMOS; ICC @ Nom Voltage(Max)(mA): 0.01; Input Type: CMOS/TTL; Bits(#): 1; F @ Nom Voltage(Max)(Mhz): 150; Rating: Catalog; Technology Family: LVC; Voltage(Nom)(V): 1.8,2.5,3.3,5; Schmitt Trigger: No; Output Drive (IOL/IOH)(Max)(mA): 32/-32; tpd @ Nom Voltage(Max)(ns): 4.5,6,4,5; Logic: True; Gate Type: AND; DatasheetVersion: SCES217Y; PackageReference: DBV0005A; Supplier 2: Mouser; Supplier Part Number 2: 595-SN74LVC1G08DBVR; Supplier 1: Digi-Key; Supplier Part Number 1: 296-11601-2-ND; Supplier 3: Digi-Key; Supplier Part Number 3: 296-11601-1-ND; Supplier 4: Digi-Key; Supplier Part Number 4: 296-11601-6-ND; Generic Part Number: SN74LVC1G08; Operating Temperature: -40°C ~ 125°C; Sub-Family: AND Gate; 3-State Output: No; Manufacturer Part Number 1: SN74LVC1G08DBVR; ComponentLink1Description: Manufacturer URL; ComponentLink1URL: C:\Users\Public\Documents\Altium\AD16\Library\PDF\sn74lvc1g08.pdf
Y1 = XTAL 25MHz 4 pins 3225: Crystal 25MHz 4 pins 3225; Manufacturer 1: Murata Electronics North America; Manufacturer Part Number 1: ABM8G-25.000MHZ-B4Y-T; Frequency Stability: ±20ppm; Frequency Tolerance: ±30ppm; Load Capacitance: 6pF; Operating Mode: Fundamental; Populated: Yes; Description_: Crystal 25MHz 6pF SMD 4Pin DFN LCC; Revision: A; RoHS: RoHS Compliant; Category: Crystals and Oscillators; Packaging: Cut Tape (CT); Type: MHz Crystal; Operating Temperature: -30°C ~ 85°C; Package / Case: 4-SMD, No Lead (DFN, LCC); Size / Dimension: 3.2 mm x 2.5mm; ComponentLink1URL: http://search.murata.co.jp/Ceramy/image/img/w_hinm/; ComponentLink1Description: http://search.murata.co.jp/Ceramy/image/img/w_hinm/; Supplier 1: Mouser; Supplier Part Number 1: 815-ABM8G-25-B4Y-T